# EAGLE design Pico Primer Kit v1.0 (EAGLE 6.1)
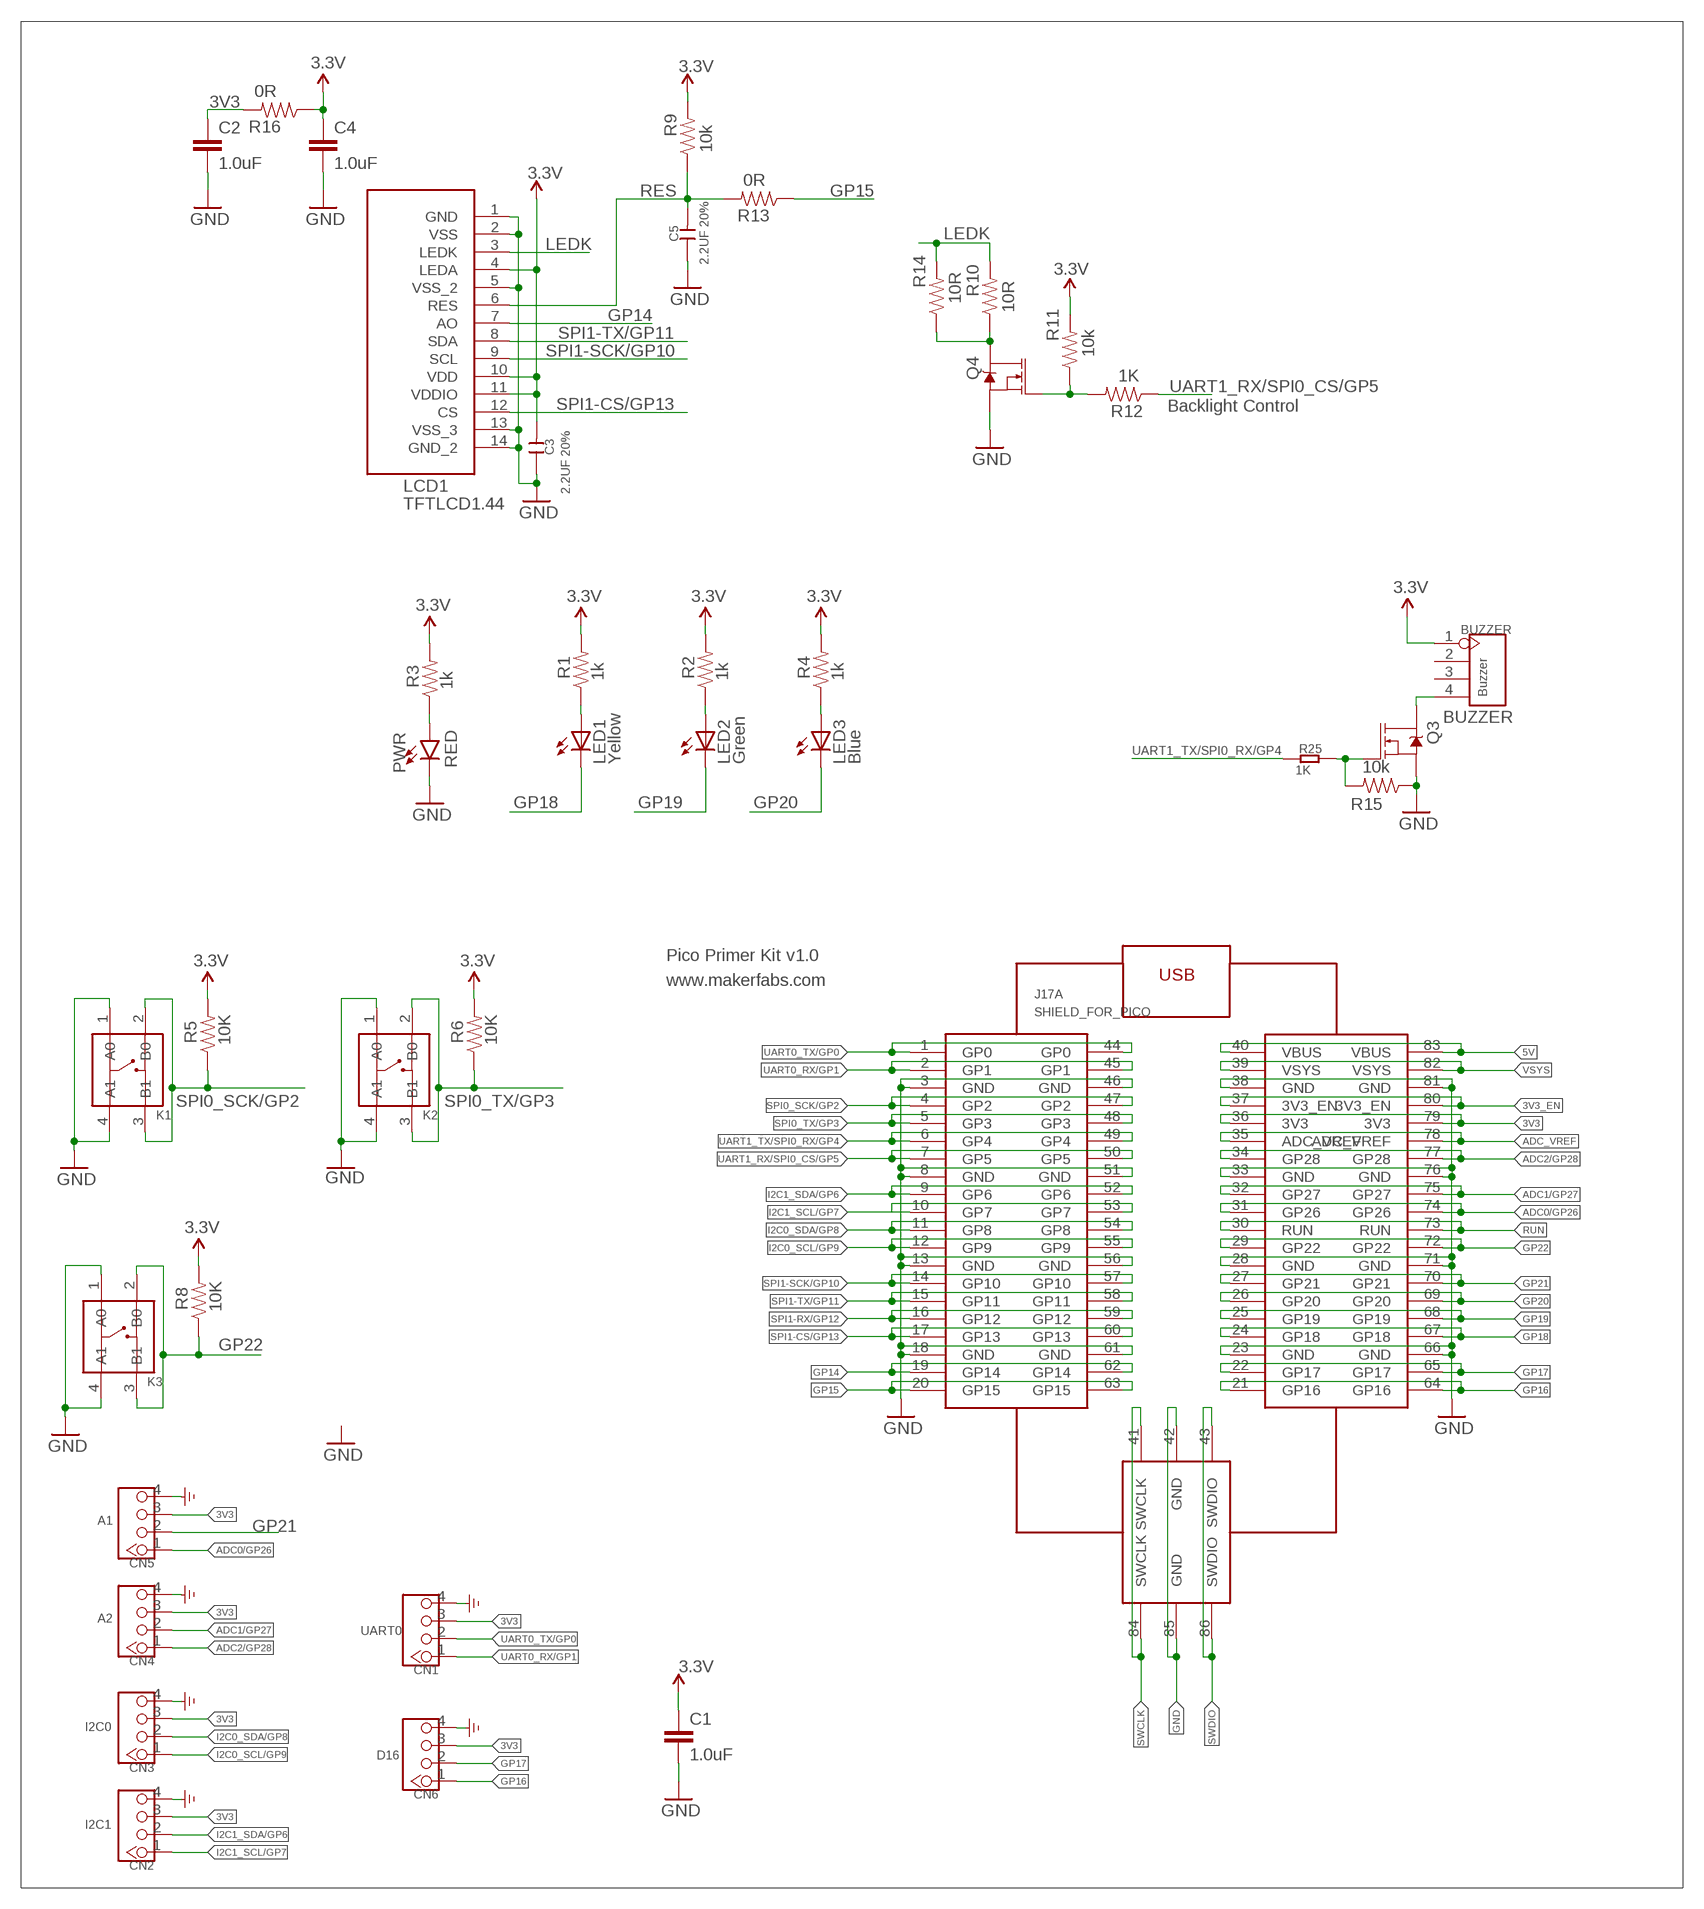
[diagram p0: schematic, sheet 1]

## Parts
BUZZER  Buzzer  HEADER-4P-60/35MILROUND  [4P-65/35ROUND]
C1  1.0uF  1.0UF-0603-16V-10%  [0603]
C2  1.0uF  1.0UF-0603-16V-10%  [0603]
C3  2.2UF 20%  C-0603  [0603]
C4  1.0uF  1.0UF-0603-16V-10%  [0603]
C5  2.2UF 20%  C-0603  [0603]
CN1  UART0  TWIG-4P-2.0-2.0  [4P-2.0]
CN2  I2C1  TWIG-4P-2.0-2.0  [4P-2.0]
CN3  I2C0  TWIG-4P-2.0-2.0  [4P-2.0]
CN4  A2  TWIG-4P-2.0-2.0  [4P-2.0]
CN5  A1  TWIG-4P-2.0-2.0  [4P-2.0]
CN6  D16  TWIG-4P-2.0-2.0  [4P-2.0]
J17A  SHIELD_FOR_PICO  [SHIELD_FOR_PICO]
K1  BUTTON-4P-3100010P1  [4P-SMD-6.0X6.0X5.0H]
K2  BUTTON-4P-3100010P1  [4P-SMD-6.0X6.0X5.0H]
K3  BUTTON-4P-3100010P1  [4P-SMD-6.0X6.0X5.0H]
LCD1  TFTLCD1.44  [TFTLCD1.44]
LED1  Yellow  LED3MM  [LED3MM]
LED2  Green  LED3MM  [LED3MM]
LED3  Blue  LED3MM  [LED3MM]
PWR  RED  LED-RED0603  [LED-0603]
Q3  220mA/50V/3.5Ω  MOSFET-NCH-BSS138  [SOT23-3]
Q4  220mA/50V/3.5Ω  MOSFET-NCH-BSS138  [SOT23-3]
R1  1k  1KOHM-0603-1/10W-1%  [0603]
R2  1k  1KOHM-0603-1/10W-1%  [0603]
R3  1k  1KOHM-0603-1/10W-1%  [0603]
R4  1k  1KOHM-0603-1/10W-1%  [0603]
R5  10K  1KOHM-0603-1/10W-1%  [0603]
R6  10K  1KOHM-0603-1/10W-1%  [0603]
R8  10K  1KOHM-0603-1/10W-1%  [0603]
R9  10k  10KOHM-0603-1/10W-1%  [0603]
R10  10R  10KOHM-0603-1/10W-1%  [0603]
R11  10k  10KOHM-0603-1/10W-1%  [0603]
R12  1K  10KOHM-0603-1/10W-1%  [0603]
R13  0R  10KOHM-0603-1/10W-1%  [0603]
R14  10R  10KOHM-0603-1/10W-1%  [0603]
R15  10k  10KOHM-0603-1/10W-1%  [0603]
R16  0R  10KOHM-0603-1/10W-1%  [0603]
R25  1K  R-0603  [R0603]

## Nets
3.3V: BUZZER.1 C1.1 C3.2 C4.1 LCD1.4(LEDA) LCD1.10(VDD) LCD1.11(VDDIO) R1.2 R2.2 R3.2 R4.2 R5.2 R6.2 R8.2 R9.2 R11.2 R16.1
3V3: C2.1 CN1.3 CN2.3 CN3.3 CN4.3 CN5.3 CN6.3 J17A.36(3V3) J17A.79(3V3) R16.2
3V3_EN: J17A.37(3V3_EN) J17A.80(3V3_EN)
5V: J17A.40(VBUS) J17A.83(VBUS)
ADC0/GP26: CN5.1 J17A.31(GP26) J17A.74(GP26)
ADC1/GP27: CN4.2 J17A.32(GP27) J17A.75(GP27)
ADC2/GP28: CN4.1 J17A.34(GP28) J17A.77(GP28)
ADC_VREF: J17A.35(ADC_VREF) J17A.78(ADC_VREF)
GND: C1.2 C2.2 C3.1 C4.2 C5.1 CN1.4 CN2.4 CN3.4 CN4.4 CN5.4 CN6.4 J17A.3(GND) J17A.8(GND) J17A.13(GND) J17A.18(GND) J17A.23(GND) J17A.28(GND) J17A.33(GND) J17A.38(GND) J17A.42(GND) J17A.46(GND) J17A.51(GND) J17A.56(GND) J17A.61(GND) J17A.66(GND) J17A.71(GND) J17A.76(GND) J17A.81(GND) J17A.85(GND) K1.1(A0) K1.4(A1) K2.1(A0) K2.4(A1) K3.1(A0) K3.4(A1) LCD1.1(GND) LCD1.2(VSS) LCD1.5(VSS_2) LCD1.13(VSS_3) LCD1.14(GND_2) PWR.C Q3.2(S) Q4.2(S) R15.1 ; supply symbol labelled GND_POWER
GP14: J17A.19(GP14) J17A.62(GP14) LCD1.7(AO)
GP15: J17A.20(GP15) J17A.63(GP15) R13.1
GP16: CN6.1 J17A.21(GP16) J17A.64(GP16)
GP17: CN6.2 J17A.22(GP17) J17A.65(GP17)
GP18: J17A.24(GP18) J17A.67(GP18) LED1.K(C)
GP19: J17A.25(GP19) J17A.68(GP19) LED2.K(C)
GP20: J17A.26(GP20) J17A.69(GP20) LED3.K(C)
GP21: CN5.2 J17A.27(GP21) J17A.70(GP21)
GP22: J17A.29(GP22) J17A.72(GP22) K3.2(B0) K3.3(B1) R8.1
I2C0_SCL/GP9: CN3.1 J17A.12(GP9) J17A.55(GP9)
I2C0_SDA/GP8: CN3.2 J17A.11(GP8) J17A.54(GP8)
I2C1_SCL/GP7: CN2.1 J17A.10(GP7) J17A.53(GP7)
I2C1_SDA/GP6: CN2.2 J17A.9(GP6) J17A.52(GP6)
LEDK: LCD1.3(LEDK) R10.2 R14.2
N$1: LED1.A R1.1
N$3: PWR.A R3.1
N$4: Q4.3(D) R10.1 R14.1
N$5: Q4.1(G) R11.1 R12.2
N$6: LED2.A R2.1
N$7: LED3.A R4.1
N$15: BUZZER.4 Q3.3(D)
N$16: Q3.1(G) R15.2 R25.2
RES: C5.2 LCD1.6(RES) R9.1 R13.2
RUN: J17A.30(RUN) J17A.73(RUN)
SPI0_SCK/GP2: J17A.4(GP2) J17A.47(GP2) K1.2(B0) K1.3(B1) R5.1
SPI0_TX/GP3: J17A.5(GP3) J17A.48(GP3) K2.2(B0) K2.3(B1) R6.1
SPI1-CS/GP13: J17A.17(GP13) J17A.60(GP13) LCD1.12(CS)
SPI1-RX/GP12: J17A.16(GP12) J17A.59(GP12)
SPI1-SCK/GP10: J17A.14(GP10) J17A.57(GP10) LCD1.9(SCL)
SPI1-TX/GP11: J17A.15(GP11) J17A.58(GP11) LCD1.8(SDA)
SWCLK: J17A.41(SWCLK) J17A.84(SWCLK)
SWDIO: J17A.43(SWDIO) J17A.86(SWDIO)
UART0_RX/GP1: CN1.1 J17A.2(GP1) J17A.45(GP1)
UART0_TX/GP0: CN1.2 J17A.1(GP0) J17A.44(GP0)
UART1_RX/SPI0_CS/GP5: J17A.7(GP5) J17A.50(GP5) R12.1
UART1_TX/SPI0_RX/GP4: J17A.6(GP4) J17A.49(GP4) R25.1
VSYS: J17A.39(VSYS) J17A.82(VSYS)
Unconnected: BUZZER.2 BUZZER.3

## Notes on the sheet
- Backlight Control
- BUZZER
- Pico Primer Kit v1.0
- www.makerfabs.com

## Library data of the parts
BUZZER = Connector:HEADER-4P
C1 C2 C4 = SparkFun-Capacitors:1.0UF: 1µF ceramic capacitors A capacitor is a passive two-terminal electrical component used to store electrical energy temporarily in an electric field.; PROD_ID: CAP-00868
C3 C5 = Discrete:C*: Ceramic Capacitors
CN1-CN6 = Connector:TWIG-4P-2.0
J17A = Shield_for_PICO:SHIELD_FOR_PICO
K1-K3 = OPL Eagle Library:BUTTON-4P
LCD1 = OLED:TFTLCD1.44
LED1-LED3 = led:LED: LED OSRAM: - CHIPLED LG R971, LG N971, LY N971, LG Q971, LY Q971, LO R971, LY R971 LH N974, LH R974 LS Q976, LO Q976, LY Q976 LO Q996 - Hyper CHIPLED LW Q18S LB Q993, LB Q99A, LB R99A - SideLED LS A670, LO A670, LY A670, LG A670, LP A670 LB A673, LV A673, LT A673, LW A673 LH A674 LY A675 LS A676, LA A676, LO A676, LY A676, LW A676 LS A679, LY A679, LG A679 - Hyper Micro SIDELED® LS Y876, LA Y876, LO Y876, LY Y876 LT Y87S - SmartLED LW L88C, LW L88S LB L89C, LB L89S, LG L890 LS L89K, LO L89K, LY L89K LS L896, LA L896, LO L896, LY L896 - TOPLED LS T670, LO T670, LY T670, LG T670, LP T670 LSG T670, LSP T670, LSY T670, LOP T670, LYG T670 LG T671, LOG T671, LSG T671 LB T673, LV T673, LT T673, LW T673 LH T674 LS T676, LA T676, LO T676, LY T676, LB T676, LH T676, LSB T676, LW T676 LB T67C, LV T67C, LT T67C, LS T67K, LO T67K, LY T67K, LW E67C LS E67B, LA E67B, LO E67B, LY E67B, LB E67C, LV E67C, LT E67C LW T67C LS T679, LY T679, LG T679 LS T770, LO T770, LY T770, LG T770, LP T770 LB T773, LV T773, LT T773, LW T773 LH T774 LS E675, LA E675, LY E675, LS T675 LS T776, LA T776, LO T776, LY T776, LB T776 LHGB T686 LT T68C, LB T68C - Hyper Mini TOPLED® LB M676 - Mini TOPLED Santana® LG M470 LS M47K, LO M47K, LY M47K Source: http://www.osram.convergy.de LUXEON: - LUMILED® LXK2-PW12-R00, LXK2-PW12-S00, LXK2-PW14-U00, LXK2-PW14-V00 LXK2-PM12-R00, LXK2-PM12-S00, LXK2-PM14-U00 LXK2-PE12-Q00, LXK2-PE12-R00, LXK2-PE12-S00, LXK2-PE14-T00, LXK2-PE14-U00 LXK2-PB12-K00, LXK2-PB12-L00, LXK2-PB12-M00, LXK2-PB14-N00, LXK2-PB14-P00, LXK2-PB14-Q00 LXK2-PR12-L00, LXK2-PR12-M00, LXK2-PR14-Q00, LXK2-PR14-R00 LXK2-PD12-Q00, LXK2-PD12-R00, LXK2-PD12-S00 LXK2-PH12-R00, LXK2-PH12-S00 LXK2-PL12-P00, LXK2-PL12-Q00, LXK2-PL12-R00 Source: www.luxeon.com KINGBRIGHT: KA-3528ASYC Source: www.kingbright.com
PWR = SparkFun-LED:LED-RED: Red SMD LED Used in manufacturing of most products at SparkFun Packages: 0603 - SMD 0603 package [Product Link] <http://docs.avagotech.com/docs/AV02-0551EN> 0603 SMART - SMD 0603 SMART package ( more efficient and expensive)[Product Link] <http://www.osram-os.com/Graphics/XPic2/00077099_0.pdf> 1206 - SMD1206 package [Product Link] <https://www.sparkfun.com/datasheets/DevTools/LilyPad/Q150OVS4.pdff> SparkFun Products: Pro Mini 328 -5V <https://www.sparkfun.com/products/821> RedBoard <https://www.sparkfun.com/products/12757> IOIO-OTG <https://www.sparkfun.com/products/13613>; PROD_ID: DIO-00819
Q3 Q4 = SparkFun-DiscreteSemi:MOSFET-NCH: N-channel MOSFETs Voltage controlled devices that allow control of high current outputs. SparkFun Products: SparkFun OpenScale <https://www.sparkfun.com/products/13261> SparkFun Digital Sandbox <https://www.sparkfun.com/products/12651> SparkFun Monster Moto Shield <https://www.sparkfun.com/products/10182> SparkFun MOSFET Power Controller <https://www.sparkfun.com/products/11214>; PROD_ID: TRANS-00830
R1-R4 = SparkFun-Resistors:1KOHM: 1kΩ resistor A resistor is a passive two-terminal electrical component that implements electrical resistance as a circuit element. Resistors act to reduce current flow, and, at the same time, act to lower voltage levels within circuits. - Wikipedia; PROD_ID: RES-07856
R5 R6 R8 = SparkFun-Resistors:1KOHM: 1kΩ resistor A resistor is a passive two-terminal electrical component that implements electrical resistance as a circuit element. Resistors act to reduce current flow, and, at the same time, act to lower voltage levels within circuits. - Wikipedia; PROD_ID: RES-07856; VALUE: 1k
R9 R11 R15 = SparkFun-Resistors:10KOHM: 10kΩ resistor A resistor is a passive two-terminal electrical component that implements electrical resistance as a circuit element. Resistors act to reduce current flow, and, at the same time, act to lower voltage levels within circuits. - Wikipedia; PROD_ID: RES-00824
R10 R12-R14 R16 = SparkFun-Resistors:10KOHM: 10kΩ resistor A resistor is a passive two-terminal electrical component that implements electrical resistance as a circuit element. Resistors act to reduce current flow, and, at the same time, act to lower voltage levels within circuits. - Wikipedia; PROD_ID: RES-00824; VALUE: 10k
R25 = Discrete:R*

## Net classes
0 default: width 0.203 mm, drill 0.305 mm, clearance 0.152 mm
2 gnd: width 0.305 mm, drill 0.559 mm, clearance 0.254 mm
3 usbvcc: width 0.508 mm, drill 0.61 mm, clearance 0.254 mm

## Board
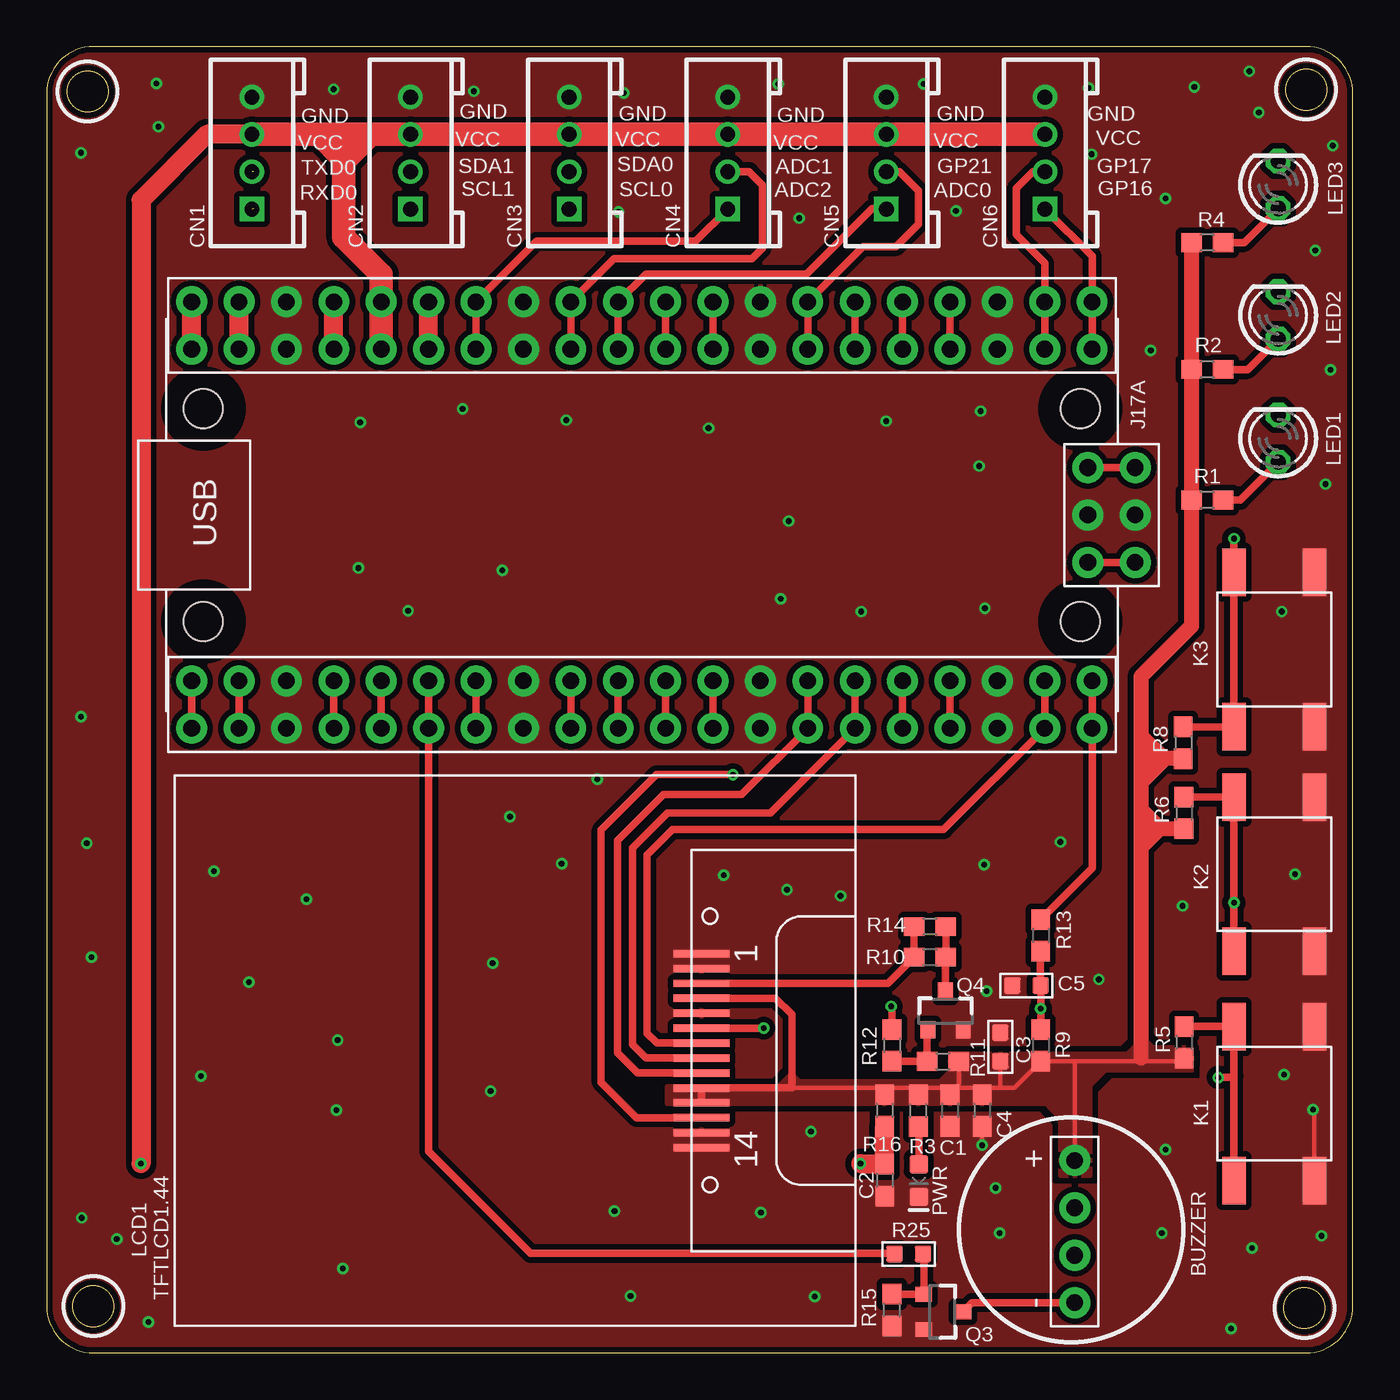
[diagram p1: board, top side]
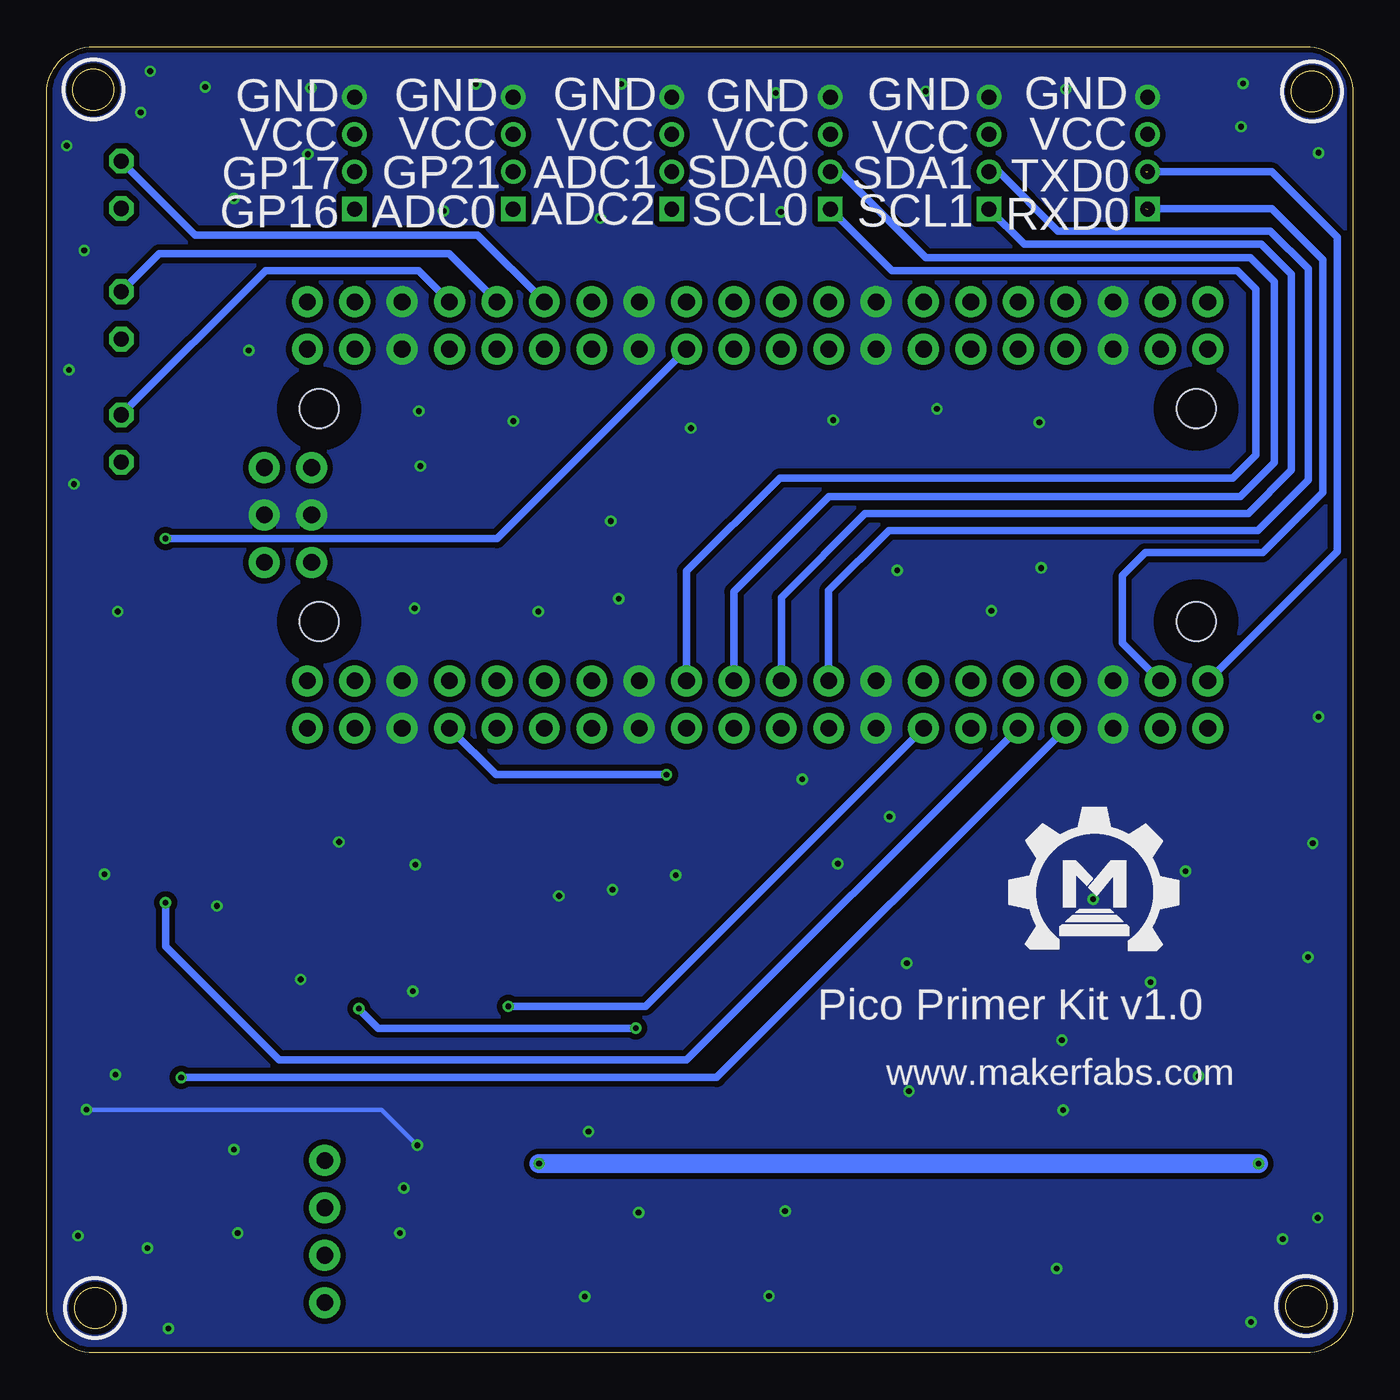
[diagram p2: board, bottom side, seen from below]

Size 70 x 70 mm. Coordinates in mm from the lower left corner, seen from the top.
Outline: 67.5,70 2.5,70 arc90 0,67.5 0,2.5 arc90 2.5,0 67.5,0 arc90 70,2.5 70,67.5 arc90 67.5,70
Outline: circle at 2.5,2.5 radius 1.1
Outline: circle at 2.2,67.6 radius 1.1
Outline: circle at 67.5,67.7 radius 1.1
Outline: circle at 67.4,2.4 radius 1.1
Copper layers (1*16): Top 0.035mm / dielectric 1.5mm / Bottom 0.035mm
Design rules: minimum track width 6mil, minimum drill 12mil, track to track 6mil, track to pad 6mil, pad to pad 6mil, via to via 6mil, smd to smd 0mil, copper to edge 10mil, drill to drill 10mil, minimum pad ring 10mil, minimum via ring 6mil, stop-mask expansion 2mil, vias tented up to drill 100mil, thermal gap 0mil

### Footprints (pad centres in the part's own frame; a part is rotated, then mirrored left to right if it is on the bottom)
4P-65/35ROUND = drill 0.889 pad 1.651: 1 0,3.81; 2 0,1.27; 3 0,-1.27; 4 0,-3.81
0603 = smd 1.1 x 1: 1 -0.85,0; 2 0.85,0
0603' = smd 0.889 x 0.889: 1 -0.762,0; 2 0.762,0
4P-2.0 = drill 0.8 pad 1.27 square: 1 -3,0 | drill 0.8 pad 1.27: 2 -1,0; 3 1,0; 4 3,0
SHIELD_FOR_PICO = drill 0.889 pad 1.651: 1 -8.89,24.13; 2 -8.89,21.59; 3 -8.89,19.05; 4 -8.89,16.51; 5 -8.89,13.97; 6 -8.89,11.43; 7 -8.89,8.89; 8 -8.89,6.35; 9 -8.89,3.81; 10 -8.89,1.27; 11 -8.89,-1.27; 12 -8.89,-3.81; 13 -8.89,-6.35; 14 -8.89,-8.89; 15 -8.89,-11.43; 16 -8.89,-13.97; 17 -8.89,-16.51; 18 -8.89,-19.05; 19 -8.89,-21.59; 20 -8.89,-24.13; 21 8.89,-24.13; 22 8.89,-21.59; 23 8.89,-19.05; 24 8.89,-16.51; 25 8.89,-13.97; 26 8.89,-11.43; 27 8.89,-8.89; 28 8.89,-6.35; 29 8.89,-3.81; 30 8.89,-1.27; 31 8.89,1.27; 32 8.89,3.81; 33 8.89,6.35; 34 8.89,8.89; 35 8.89,11.43; 36 8.89,13.97; 37 8.89,16.51; 38 8.89,19.05; 39 8.89,21.59; 40 8.89,24.13; 41 -2.54,-23.9; 42 0,-23.9; 43 2.54,-23.9; 44 -11.43,24.13; 45 -11.43,21.59; 46 -11.43,19.05; 47 -11.43,16.51; 48 -11.43,13.97; 49 -11.43,11.43; 50 -11.43,8.89; 51 -11.43,6.35; 52 -11.43,3.81; 53 -11.43,1.27; 54 -11.43,-1.27; 55 -11.43,-3.81; 56 -11.43,-6.35; 57 -11.43,-8.89; 58 -11.43,-11.43; 59 -11.43,-13.97; 60 -11.43,-16.51; 61 -11.43,-19.05; 62 -11.43,-21.59; 63 -11.43,-24.13; 64 11.43,-24.13; 65 11.43,-21.59; 66 11.43,-19.05; 67 11.43,-16.51; 68 11.43,-13.97; 69 11.43,-11.43; 70 11.43,-8.89; 71 11.43,-6.35; 72 11.43,-3.81; 73 11.43,-1.27; 74 11.43,1.27; 75 11.43,3.81; 76 11.43,6.35; 77 11.43,8.89; 78 11.43,11.43; 79 11.43,13.97; 80 11.43,16.51; 81 11.43,19.05; 82 11.43,21.59; 83 11.43,24.13; 84 -2.54,-26.44; 85 0,-26.44; 86 2.54,-26.44 | hole 2.1: -5.7,23.5; 5.7,23.5; 5.7,-23.5; -5.7,-23.5
4P-SMD-6.0X6.0X5.0H = smd 2.54 x 1.27: 1 -4.129,2.159; 2 -4.129,-2.159; 3 4.129,-2.159; 4 4.129,2.159
TFTLCD1.44 = smd 0.4 x 3: 1 5.2,-10; 2 4.4,-10; 3 3.6,-10; 4 2.8,-10; 5 2,-10; 6 1.2,-10; 7 0.4,-10; 8 -0.4,-10; 9 -1.2,-10; 10 -2,-10; 11 -2.8,-10; 12 -3.6,-10; 13 -4.4,-10; 14 -5.2,-10
LED3MM = drill 0.813 octagon: A -1.27,0; K 1.27,0
LED-0603 = smd 1 x 1: A -0.877,0; C 0.877,0
SOT23-3 = smd 0.8 x 0.9: 1 -0.95,-1; 2 0.95,-1; 3 0,1.1
R0603 = smd 0.889 x 0.889: 1 -0.762,0; 2 0.762,0

### Placement (x,y rotation side)
BUZZER  55.1,6.5 0 top
C1  48.41,12.99 270 top
C2  44.9,9.26 270 top
C3  2.2UF 20%  [0603']  51.11,16.4 270 top
C4  50.13,12.99 270 top
C5  2.2UF 20%  [0603']  52.51,19.69 0 top
CN1  11,64.3 90 top
CN2  19.5,64.3 90 top
CN3  28,64.3 90 top
CN4  36.5,64.3 90 top
CN5  45,64.3 90 top
CN6  53.5,64.3 90 top
J17A  31.9,44.9 90 top
K1  65.79,13.36 270 top
K2  65.79,25.65 270 top
K3  65.79,37.69 270 top
LCD1  25.1,16.2 90 top
LED1  66,49 90 top
LED2  66,55.6 90 top
LED3  66,62.6 90 top
PWR  46.74,9.23 270 top
Q3  48,2.2 270 top
Q4  48.17,18.3 0 top
R1  62.2,45.7 180 top
R2  62.2,52.7 180 top
R3  46.72,12.98 90 top
R4  62.2,59.5 180 top
R5  60.95,16.64 270 top
R6  60.95,28.93 270 top
R8  60.9,32.7 270 top
R9  53.27,16.47 270 top
R10  47.33,21.2 180 top
R11  48.03,15.62 0 top
R12  45.3,16.47 270 top
R13  53.28,22.37 270 top
R14  47.33,22.85 180 top
R15  45.3,2.3 90 top
R16  44.9,12.99 270 top
R25  46.2,5.3 0 top
U$1  [MAKERFABS_0.3]  17.97,21.61 0 bottom

### Tracks (layer width: path | path; a pad name or v marks a point on that pad's centre or on a via)
3.3V
  Top 0.254: 39.93,14.2 44.98,14.2 | 44.98,14.2 46.81,14.2 | 46.81,14.2 48.56,14.2 | 48.56,14.2 48.79,14.2 | 48.79,14.2 50.19,14.2 | 50.19,14.2 51.1,14.2 | 51.1,14.2 51.85,14.2 R9.2 55.17,15.62 | 55.17,15.62 58.73,15.62 | 58.73,15.62 60.78,15.62 R5.2 | 58.65,15.79 58.65,15.7 58.73,15.62 | BUZZER.1 55.1,15.55 55.17,15.62 | 50.19,14.2 50.13,14.14 C4.1 | 48.56,14.2 48.41,14.04 C1.1 | 44.98,14.2 44.9,14.12 R16.1 | 46.81,14.2 46.72,14.11 R3.2 | R11.2 48.88,14.28 48.79,14.2 | C3.2 51.11,14.2 51.1,14.2
  Top 0.406: LCD1.11 LCD1.10 39.93,14.2 39.93,18.14 39.06,19 LCD1.4
  Top 0.813: R4.2 R2.2 R1.2 61.35,38.95 58.65,36.25 58.65,33.1 | 58.65,33.1 58.65,31.85 | 58.65,31.85 58.65,29.11 | 58.65,29.11 58.65,28.04 | 58.65,28.04 58.65,15.79 | R8.2 58.65,31.85 | R6.2 58.69,28.08 58.65,28.04 | 58.65,33.1 59.89,31.85 59.92,31.85 58.67,30.61 | 58.65,29.11 59.66,28.09 58.67,27.1
  pour Top: 33.25,14.27 39.22,14.27 39.83,14.88 40.01,14.88 40.34,14.55 47.88,14.55 48.41,15.09 48.41,16.03 57.91,16.03 58.55,16.66 58.98,16.66 59.28,16.36 61.39,16.36 61.39,15.14 56.74,15.14 55.93,14.33 55.93,9.5 54.33,9.5 54.33,12.57 53.85,13.06 53.57,13.34 33.5,13.34 33.25,13.34
3V3  (via drill 0.3)
  Top 1.016: R16.2 C2.1 44.88,10.13 v43.61,10.13 | 16.03,63.7 14.38,65.35 17.6,65.35 16.03,63.78 | 16.03,63.78 16.03,63.75 | 16.03,63.78 16.03,64.82 15.93,64.92 | CN1.3 8.58,65.3 5.05,61.77 v5.05,10.13
  Top 1.27: CN2.3 16.2,65.3 15.93,65.02 15.93,64.92 15.93,59.79 17.93,57.79 J17A.79 J17A.36 | CN2.3 CN3.3 CN4.3 CN5.3 CN6.3 | CN1.3 CN2.3
  Bottom 1.016: v5.05,10.13 v43.61,10.13
3V3_EN
  Top 1.016: J17A.37 J17A.80
5V
  Top 1.016: J17A.40 J17A.83
ADC0/GP26
  Top 0.406: J17A.31 J17A.74 32.11,57.81 40.72,57.81 44.22,61.32 44.98,61.32 CN5.1
ADC1/GP27
  Top 0.406: J17A.32 J17A.75 30.41,58.65 37.8,58.65 38.35,59.21 38.35,62.59 37.64,63.3 CN4.2
ADC2/GP28
  Top 0.406: J17A.34 J17A.77 26.24,59.56 34.77,59.56 CN4.1
ADC_VREF
  Top 1.016: J17A.35 J17A.78
GND  (via drill 0.3)
  Top 0.254: C4.2 v50.13,11.13 v50.14,11.12 | v67.87,13.03 67.94,12.95 K1.4
  Bottom 0.254: v50.14,11.12 52.05,13.03 v67.87,13.03
  other vias: 2.4,21.21 50.37,19.38 50.24,26.16 39.67,24.82 42.55,24.49 54.33,27.38 56.39,20.02 66.19,39.73 66.9,25.65 66.32,14.91 68.33,6.27 64.59,5.61 63.47,1.3 59.77,6.43 51.08,6.43 15.88,4.52 31.29,3.05 30.43,7.59 38.28,7.52 23.9,20.88 15.52,13 13.92,24.31 8.97,25.81 15.6,16.76 5.46,1.65 3.76,6.1 1.88,7.24 2.15,27.3 1.84,34.09 19.37,39.78 16.8,49.86 27.85,49.99 39.77,44.58 43.65,39.73 50.28,39.9 39.33,40.41 49.98,47.52 45,49.94 50.05,50.47 16.7,42.06 24.42,41.94 35.47,49.55 22.29,50.6 5.88,68.02 5.98,65.71 1.84,64.31 15.38,67.72 22.9,67.61 30.93,67.51 30.65,61.14 39.21,68 47,68 48.73,61.19 40.32,60.81 55.84,67.79 61.51,67.84 64.45,68.68 68.92,64.69 64.96,66.47 56,64.24 59.96,61.87 67.98,59.08 68.8,52.68 68.54,46.56 59.17,53.72 60.87,23.95 59.96,10.9 50.87,8.84 41.16,3.02 40.96,11.86 36.29,25.6 29.5,30.73 24.83,28.73 27.6,26.21 23.79,14.02 10.83,19.86 8.27,14.83
  pour Bottom (isolate 0.305, rank 6): -3,-1 75,-1 75,75 -3,75
  pour Top (isolate 0.305, rank 6): -2,-1 75,-1 75,75 -2,75
GP14
  Top 0.406: J17A.19 J17A.62 48.06,28.04 33.53,28.04 32.18,26.7 32.18,17.12 32.7,16.6 LCD1.7
GP15
  Top 0.406: J17A.20 J17A.63 56.03,25.98 R13.1
GP16
  Top 0.406: J17A.21 J17A.64 56.03,58.77 CN6.1
GP17
  Top 0.406: J17A.22 J17A.65 53.49,58.4 51.97,59.92 51.97,62.41 52.86,63.3 CN6.2
GP18
  Top 0.406: J17A.24 J17A.67
  Bottom 0.406: J17A.67 50.08,58 58.27,58 LED1.K
GP19
  Top 0.406: J17A.25 J17A.68
  Bottom 0.406: J17A.68 48.44,58.9 63.97,58.9 LED2.K
GP20
  Top 0.406: J17A.26 J17A.69
  Bottom 0.406: J17A.69 46.9,59.9 62.03,59.9 LED3.K
GP21
  Top 0.406: J17A.27 J17A.70 43.74,59.28 45.52,59.28 46.71,60.48 46.71,62.28 45.69,63.3 CN5.2
GP22  (via drill 0.3)
  Top 0.406: J17A.29 J17A.72 | R8.1 63.61,33.55 K3.3 K3.2 v63.63,43.64
  Bottom 0.406: J17A.29 45.86,43.64 v63.63,43.64
I2C0_SCL/GP9
  Top 0.406: J17A.55 J17A.12
  Bottom 0.406: CN3.1 24.69,57.99 6.19,57.99 5.2,57 5.2,48.12 6.43,46.89 30.71,46.89 35.71,41.88 J17A.12
I2C0_SDA/GP8
  Top 0.406: J17A.54 J17A.11
  Bottom 0.406: CN3.2 27.48,63.3 22.89,58.7 5.5,58.7 4.2,57.4 4.2,47.72 6.02,45.9 28.07,45.9 33.17,40.79 J17A.11
I2C1_SCL/GP7
  Top 0.406: J17A.53 J17A.10
  Bottom 0.406: CN2.1 17.61,59.41 4.91,59.41 3.3,57.8 3.3,47.3 5.61,44.98 26.14,44.98 30.63,40.49 J17A.10
I2C1_SDA/GP6
  Top 0.406: J17A.52 J17A.9
  Bottom 0.406: CN2.2 18.97,63.3 15.8,60.12 4.42,60.12 2.4,58.1 2.4,46.77 5.11,44.07 24.87,44.07 28.09,40.84 J17A.9
LEDK
  Top 0.406: LCD1.3 45.08,19.8 R10.2 R14.2
N$1
  Top 0.406: R1.1 63.97,45.7 LED1.A
N$3
  Top 0.406: PWR.A 46.74,12.11 R3.1
N$4
  Top 0.406: Q4.3 48.17,21.18 R10.1 R14.1
N$5
  Top 0.406: R12.2 R11.1 47.18,17.27 Q4.1
N$6
  Top 0.406: R2.1 64.37,52.7 LED2.A
N$7
  Top 0.406: R4.1 64.17,59.5 LED3.A
N$15
  Top 0.406: BUZZER.4 49.59,2.69 Q3.3
N$16
  Top 0.406: R15.2 Q3.1 47,5.26 R25.2
RES  (via drill 0.3)
  Top 0.406: LCD1.6 v38.43,17.4 | R9.1 v53.27,18.44 C5.2 53.27,21.51 R13.2
  Bottom 0.406: v38.43,17.4 52.23,17.4 v53.27,18.44
RUN
  Top 0.406: J17A.30 J17A.73
SPI0_SCK/GP2  (via drill 0.3)
  Top 0.406: J17A.47 J17A.4 | K1.3 63.63,14.83 | 63.63,14.83 K1.2 R5.1 | v62.79,14.76 63.55,14.76 63.63,14.83
  Bottom 0.406: J17A.47 34.1,14.76 v62.79,14.76
SPI0_TX/GP3  (via drill 0.3)
  Top 0.406: J17A.48 J17A.5 | R6.1 K2.2 v63.63,24.13 63.63,23.09 K2.3
  Bottom 0.406: J17A.48 35.7,15.7 57.53,15.7 63.63,21.79 v63.63,24.13
SPI1-CS/GP13  (via drill 0.3)
  Top 0.406: J17A.60 J17A.17 | LCD1.12 31.62,12.6 29.72,14.5 29.72,28.02 32.69,30.99 v36.78,30.99
  Bottom 0.406: v36.78,30.99 45.93,30.99 J17A.60
SPI1-RX/GP12
  Top 0.406: J17A.59 J17A.16
SPI1-SCK/GP10
  Top 0.406: J17A.14 J17A.57 37.24,29.92 33.05,29.92 30.58,27.46 30.58,16.08 31.66,15 LCD1.9
SPI1-TX/GP11
  Top 0.406: J17A.15 J17A.58 38.79,28.93 33.27,28.93 31.39,27.05 31.39,16.54 32.13,15.8 LCD1.8
SWCLK
  Top 0.406: J17A.41 J17A.84
SWDIO
  Top 0.406: J17A.43 J17A.86
UART0_RX/GP1  (1 unrouted)
  Top 0.406: J17A.45 J17A.2
  Bottom 0.406: J17A.2 12.34,38.04 12.34,41.66 11.12,42.88 4.83,42.88 1.6,46.1 1.6,58.57 4.34,61.32 11.08,61.32
UART0_TX/GP0  (1 unrouted)
  Top 0.406: J17A.44 J17A.1
  Bottom 0.406: J17A.1 0.84,42.94 0.84,59.79 4.34,63.3 11.1,63.3
UART1_RX/SPI0_CS/GP5  (via drill 0.3)
  Top 0.406: J17A.50 J17A.7 | R12.1 45.3,18.53 v45.26,18.57
  Bottom 0.406: J17A.50 37.91,18.57 v45.26,18.57
UART1_TX/SPI0_RX/GP4
  Top 0.406: J17A.6 J17A.49 20.47,10.8 25.93,5.33 45.4,5.33 R25.1
VSYS
  Top 1.016: J17A.39 J17A.82

### Text on the board
tPlace: GND | GND | GND | GND | GND | GND | VCC | VCC | VCC | VCC | VCC | VCC | TXD0 | SDA1 | SDA0 | ADC1 | GP21 | GP17 | RXD0 | SCL1 | SCL0 | ADC2 | ADC0 | GP16 | + | -
bPlace: GND | GND | GND | GND | GND | GND | VCC | VCC | VCC | VCC | VCC | VCC | TXD0 | SDA1 | SDA0 | ADC1 | GP21 | GP17 | RXD0 | SCL1 | SCL0 | ADC2 | ADC0 | GP16 | Pico Primer Kit v1.0 | www.makerfabs.com